# Altium schematic sheet ATMega328.SchDoc: ATMega328-PB
size A4; Author: Andrés Gullón; DocumentNumber: 6; SheetNumber: 6; SheetTotal: 9
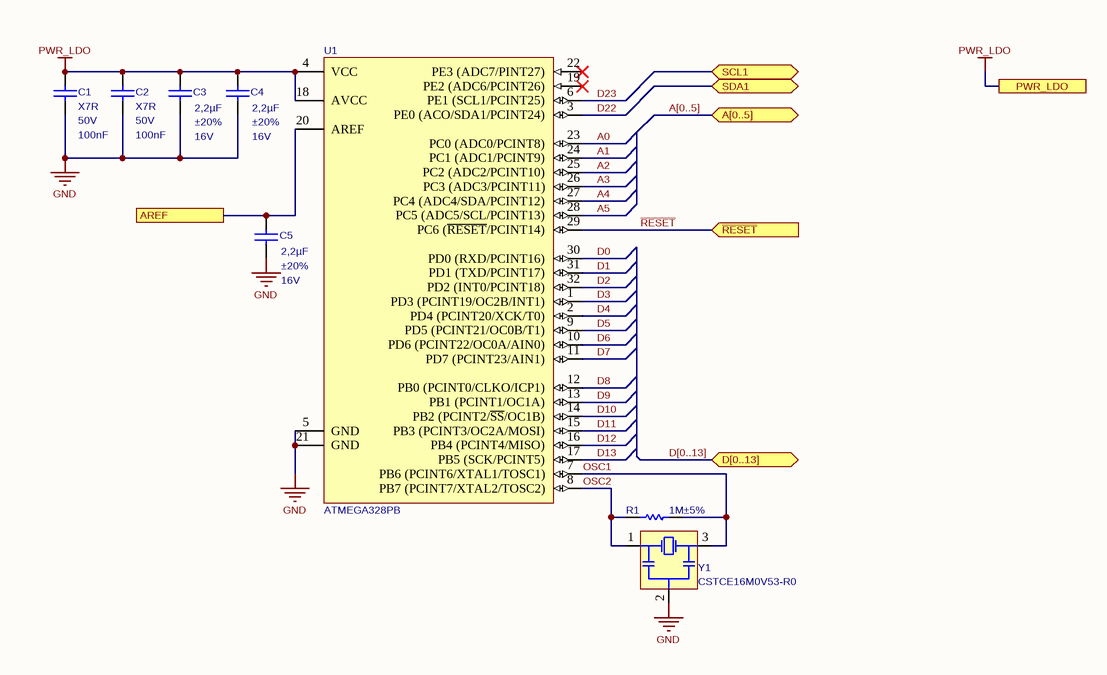
[diagram p0: ATMega328.SchDoc]

## Parts
C1  Dielectric: X7R  Voltage: 50V  Capacitance: 100nF  [C0603]  (hidden comment: C0603_100nF_50V_±10%_X7R)
C2  Dielectric: X7R  Voltage: 50V  Capacitance: 100nF  [C0603]  (hidden comment: C0603_100nF_50V_±10%_X7R)
C3  Voltage: 16V  Capacitance: 2,2µF  Tolerance: ±20%  [C0402]  (hidden comment: C0402_2.2uF_16V_±20%)
C4  Voltage: 16V  Capacitance: 2,2µF  Tolerance: ±20%  [C0402]  (hidden comment: C0402_2.2uF_16V_±20%)
C5  Voltage: 16V  Capacitance: 2,2µF  Tolerance: ±20%  [C0402]  (hidden comment: C0402_2.2uF_16V_±20%)
R1  Tolerance: ±5%  Resistance: 1M  [R0603]  (hidden comment: R0603_1M_0.1W_±5%)
U1  ATMEGA328PB  [TQFP32]
Y1  CSTCE16M0V53-R0  [Resonator_1.3x3.2]

## Ports
A[0..5] (bidir), AREF, D[0..13] (bidir), PWR_LDO, SCL1 (bidir), SDA1 (bidir), ~{RESET} (in)

## Nets
GND: C1.1 C2.1 C3.1 C4.1 C5.1 U1.5(GND) U1.21(GND) Y1.2(GND)
PWR_LDO: C1.2 C2.2 C3.2 C4.2 U1.4(VCC) U1.18(AVCC) ; port PWR_LDO
A0: U1.23(PC0_(ADC0/PCINT8))
A1: U1.24(PC1_(ADC1/PCINT9))
A2: U1.25(PC2_(ADC2/PCINT10))
A3: U1.26(PC3_(ADC3/PCINT11))
A4: U1.27(PC4_(ADC4/SDA/PCINT12))
A5: U1.28(PC5_(ADC5/SCL/PCINT13))
AREF: C5.2 U1.20(AREF) ; port AREF
D0: U1.30(PD0_(RXD/PCINT16))
D1: U1.31(PD1_(TXD/PCINT17))
D2: U1.32(PD2_(INT0/PCINT18))
D3: U1.1(PD3_(PCINT19/OC2B/INT1))
D4: U1.2(PD4_(PCINT20/XCK/T0))
D5: U1.9(PD5_(PCINT21/OC0B/T1))
D6: U1.10(PD6_(PCINT22/OC0A/AIN0))
D7: U1.11(PD7_(PCINT23/AIN1))
D8: U1.12(PB0_(PCINT0/CLKO/ICP1))
D9: U1.13(PB1_(PCINT1/OC1A))
D10: U1.14(PB2_(PCINT2/~{SS}/OC1B))
D11: U1.15(PB3_(PCINT3/OC2A/MOSI))
D12: U1.16(PB4_(PCINT4/MISO))
D13: U1.17(PB5_(SCK/PCINT5))
D22: U1.3(PE0_(ACO/SDA1/PCINT24)) ; port SDA1
D23: U1.6(PE1_(SCL1/PCINT25)) ; port SCL1
OSC1: R1.1 U1.7(PB6_(PCINT6/XTAL1/TOSC1)) Y1.3(OSC2)
OSC2: R1.2 U1.8(PB7_(PCINT7/XTAL2/TOSC2)) Y1.1(OSC1)
~{RESET}: U1.29(PC6_(~{RESET}/PCINT14)) ; port ~{RESET}

Not connected (* = marked no-connect by the designer): U1 19(PE2_(ADC6/PCINT26))* 22(PE3_(ADC7/PINT27))*

## Buses and harness runs
bus A[0..5] = port A[0..5]
bus D[0..13] = port D[0..13]

## Notes on the sheet
- Title
- Project
- Size:
- Author
- A4
- Number:
- Revision:
- Mundo Reader, S.L. This project and all the sheets and layouts enclosed are licensed under Creative Commons by Attribution and Share Alike [CC BY-SA] (www.creativecommons.com)
- Date:
- Time:
- Sheet
- of

## Library data of the parts
C1 C2 = CMP-00257-1: Manufacturer: Kemet; Description ES: Condensador; OrderingCode: C0603C104K5RAC; OrderingCode 2: 06035C104KAT2A; SchLibComponentName: Capacitor; Temp_ Max: 125; Temp_ Min: -55; Tolerance: ±10%; Value: 100nF ±10% 50V; Manufacturer 2: AVX; Part Number: C0603_100nF_50V_±10%_X7R; Price units: EUR
C3-C5 = CMP-A0550-4: C0402_2.2uF_16V_±20%_X5R; Part Number: C0402_2.2uF_16V_±10%; Manufacturer: TDK; Value: 2,2µF ±20% 16V; Dielectric: X5R; OrderingCode: C1005X5R1C225M050BC; Temp_ Max: 125; Temp_ Min: -55; AccessRights: 2147483647; ContentType: Component; Description ES: Condensador; Folder: Components Library\Pasives\Capacitor_SMD\C0402_16V$\; OrderingCode 2: EMK105ABJ225MV-F; RevisionId: 3; SchLibComponentName: Capacitor; Price units: EUR; ComponentType: Capacitor; ContentTypeGUID: CB3C11C4-E317-11DF-B822-12313F0024A2; FolderGUID: B1BE7916-43F7-4918-A273-F24409A7170B; ItemGUID: BD471B44-C1FF-4F80-85CC-AC0CC62DE9EE; ItemHRID: CMP-A0550; LifeCycle: New From Design; LifeCycleStateGUID: 706004B5-C76E-482E-903B-BA0E4FAE086A; Manufacturer 2: Taiyo Yuden; ReleaseDate: 04/09/2017 08:02:11 AM
R1 = CMP-A1358-3: Manufacturer: Vishay; OrderingCode: CRCW06031M00JN; Power: 0.1W; Value: 1M ±5% 0.1W; Temp_ Max: 155; Temp_ Min: -55; Description ES: Resistencia; SchLibComponentName: Resistor; PackageDescription: SMD; Part Number: R0603_1M_0.1W_±5%; Price units: EUR
U1 = CMP-00141-3: 8-bit Microcontrollers - MCU 32KB In-system Flash 20MHz 1.8V-5.5V; Manufacturer: Atmel; OrderingCode: ATMEGA328PB-AU; Description ES: Microcontrolador 8 bits; 32kB de memoria; Temp_ Max: 85; Temp_ Min: -40; SchLibComponentName: ATMEGA328PB; Part Number: ATMEGA328PB; Price units: EUR
Y1 = CMP-A2241-1: Resonator 16MHz; Manufacturer: Murata; Description ES: Resonador 16MHz; Temp_Max: 80; Temp_Min: -20; SchLibComponentName: Resonator 3 pin; Part Number: CSTCE16M0V53-R0; OrderingCode: CSTCE16M0V53-R0; Price units: EUR; Value: 16MHz